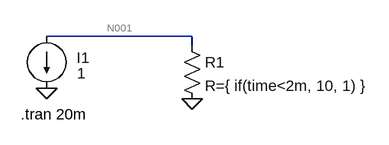
[diagram p0: schematic Resistance_TimeDependent.asc]
Resistance_TimeDependent.asc, the LTspice schematic file:
Version 4.1
SHEET 1 880 680
WIRE 288 160 64 160
WIRE 288 176 288 160
FLAG 64 240 0
FLAG 288 256 0
SYMBOL current 64 160 R0
WINDOW 0 46 33 Left 2
WINDOW 3 47 57 Left 2
WINDOW 123 0 0 Left 0
WINDOW 39 0 0 Left 0
SYMATTR InstName I1
SYMATTR Value 1
SYMBOL res 272 160 R0
SYMATTR InstName R1
SYMATTR Value R={ if(time<2m, 10, 1) }
TEXT 24 280 Left 2 !.tran 20m

The netlist it stands for:
* Resistance_TimeDependent.asc
I1 N001 0 1
R1 N001 0 R={ if(time<2m, 10, 1) }
.tran 20m
.backanno
.end

* Results of the author's LTspice run, read from the files saved beside the schematic
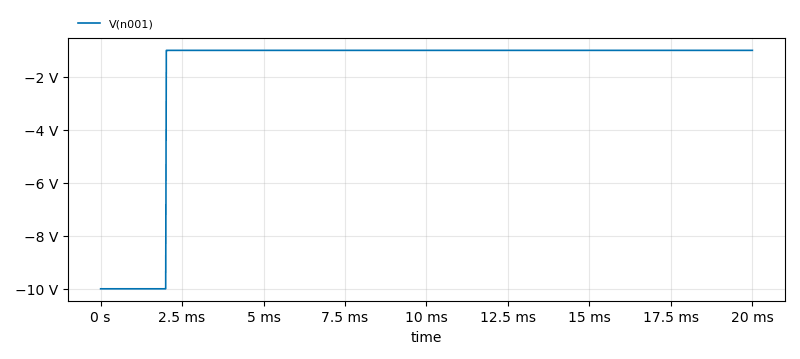
[diagram p1: Transient Analysis of Resistance_TimeDependent.asc, plotted from the saved traces]
* Transient Analysis, 1 run:
*   V(n001): min -10 V, max -1 V, average -1.904 V, rms 3.308 V, last -1 V